# Altium schematic sheet Supply_Source.SchDoc
size A4; SheetNumber: 2; SheetTotal: 15
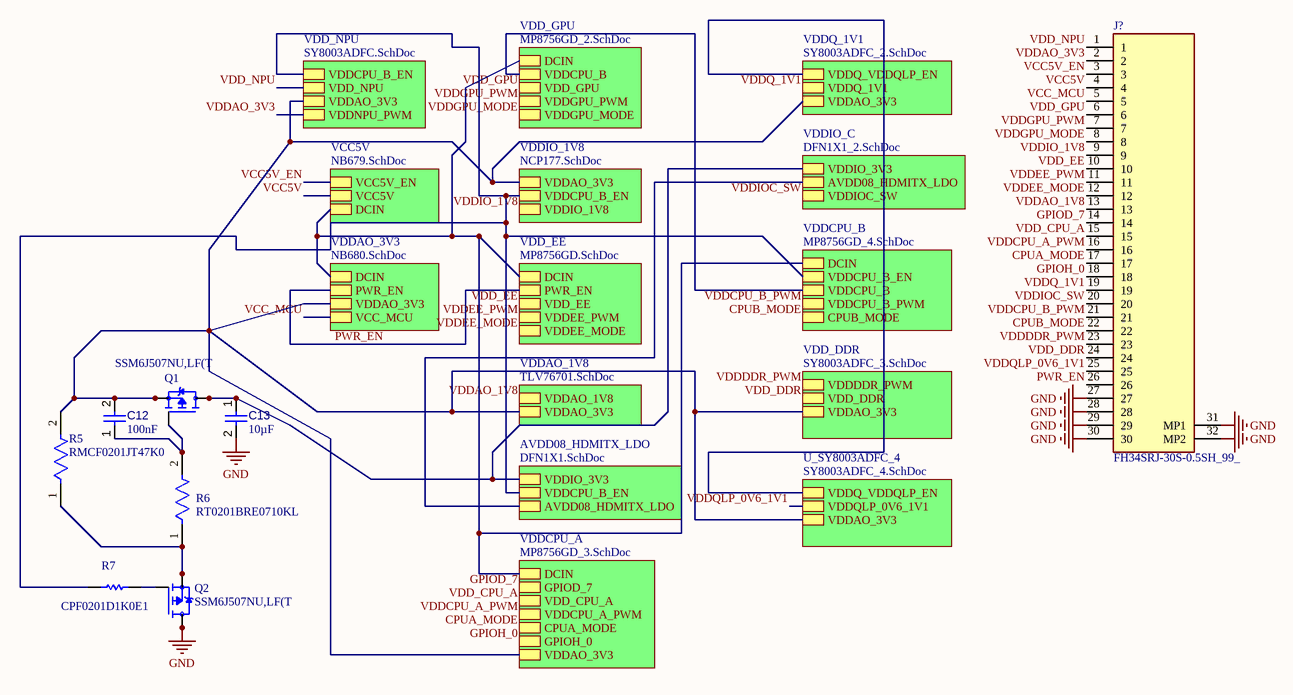
[diagram p0: Supply_Source.SchDoc]

## Parts
C12  value 100nF  [CAPC1005X56X25LL10T15]  (hidden comment: Capacitor 0.1 uF +/- 5% 16 V 0402)
C13  value 10µF  [CAPC0402(1005)60_L]  (hidden comment: Capacitor 10µF +/-40% 6.3V 0402)
J?  FH34SRJ-30S-0.5SH_99_  [FH34SRJ30S05SH99]
Q1  SSM6J507NU,LF(T  [TRANS_SSM6J507NU,LF(T]
Q2  SSM6J507NU,LF(T  [TRANS_SSM6J507NU,LF(T]
R5  RMCF0201JT47K0  [FP-RMCF0201-MFG]
R6  RT0201BRE0710KL  [FP-RT0201-MFG]
R7  CPF0201D1K0E1  [RESC0603X28X15LL05T05]

## Sub-sheets
AVDD08_HDMITX_LDO = DFN1X1.SchDoc: VDDIO_3V3, VDDCPU_B_EN, AVDD08_HDMITX_LDO
U_SY8003ADFC_4 = SY8003ADFC_4.SchDoc: VDDQ_VDDQLP_EN, VDDQLP_0V6_1V1, VDDAO_3V3
VCC5V = NB679.SchDoc: VCC5V_EN, VCC5V, DCIN
VDD_DDR = SY8003ADFC_3.SchDoc: VDDDDR_PWM, VDD_DDR, VDDAO_3V3
VDD_EE = MP8756GD.SchDoc: DCIN, PWR_EN, VDD_EE, VDDEE_PWM, VDDEE_MODE
VDD_GPU = MP8756GD_2.SchDoc: DCIN, VDDCPU_B, VDD_GPU, VDDGPU_PWM, VDDGPU_MODE
VDD_NPU = SY8003ADFC.SchDoc: VDDCPU_B_EN, VDD_NPU, VDDAO_3V3, VDDNPU_PWM
VDDAO_1V8 = TLV76701.SchDoc: VDDAO_1V8, VDDAO_3V3
VDDAO_3V3 = NB680.SchDoc: DCIN, PWR_EN, VDDAO_3V3, VCC_MCU
VDDCPU_A = MP8756GD_3.SchDoc: DCIN, GPIOD_7, VDD_CPU_A, VDDCPU_A_PWM, CPUA_MODE, GPIOH_0, VDDAO_3V3
VDDCPU_B = MP8756GD_4.SchDoc: DCIN, VDDCPU_B_EN, VDDCPU_B, VDDCPU_B_PWM, CPUB_MODE
VDDIO_1V8 = NCP177.SchDoc: VDDAO_3V3, VDDCPU_B_EN, VDDIO_1V8
VDDIO_C = DFN1X1_2.SchDoc: VDDIO_3V3, AVDD08_HDMITX_LDO, VDDIOC_SW
VDDQ_1V1 = SY8003ADFC_2.SchDoc: VDDQ_VDDQLP_EN, VDDQ_1V1, VDDAO_3V3

## Nets
GND: C13.2 J?.27 J?.28 J?.29 J?.30 J?.31(MP1) J?.32(MP2) Q2.1(D) Q2.2(D) Q2.5(D) Q2.6(D) Q2.7(D)
CPUA_MODE: J?.17 ; sheet VDDCPU_A/CPUA_MODE
CPUB_MODE: J?.22 ; sheet VDDCPU_B/CPUB_MODE
GPIOD_7: J?.14 ; sheet VDDCPU_A/GPIOD_7
GPIOH_0: J?.18 ; sheet VDDCPU_A/GPIOH_0
PWR_EN: J?.26 ; sheet VDDAO_3V3/PWR_EN, sheet VDD_EE/PWR_EN
VCC5V: J?.4 ; sheet VCC5V/VCC5V
VCC5V_EN: J?.3 ; sheet VCC5V/VCC5V_EN
VCC_MCU: J?.5 ; sheet VDDAO_3V3/VCC_MCU
VDD_CPU_A: J?.15 ; sheet VDDCPU_A/VDD_CPU_A
VDD_DDR: J?.24 ; sheet VDD_DDR/VDD_DDR
VDD_EE: J?.10 ; sheet VDD_EE/VDD_EE
VDD_GPU: J?.6 ; sheet VDD_GPU/VDD_GPU
VDD_NPU: J?.1 ; sheet VDD_NPU/VDD_NPU
VDDAO_1V8: J?.13 ; sheet VDDAO_1V8/VDDAO_1V8
VDDAO_3V3: J?.2 ; sheet VDD_NPU/VDDNPU_PWM
VDDCPU_A_PWM: J?.16 ; sheet VDDCPU_A/VDDCPU_A_PWM
VDDCPU_B_PWM: J?.21 ; sheet VDDCPU_B/VDDCPU_B_PWM
VDDDDR_PWM: J?.23 ; sheet VDD_DDR/VDDDDR_PWM
VDDEE_MODE: J?.12 ; sheet VDD_EE/VDDEE_MODE
VDDEE_PWM: J?.11 ; sheet VDD_EE/VDDEE_PWM
VDDGPU_MODE: J?.8 ; sheet VDD_GPU/VDDGPU_MODE
VDDGPU_PWM: J?.7 ; sheet VDD_GPU/VDDGPU_PWM
VDDIO_1V8: J?.9 ; sheet VDDIO_1V8/VDDIO_1V8
VDDIOC_SW: J?.20 ; sheet VDDIO_C/VDDIOC_SW
VDDQ_1V1: J?.19 ; sheet VDDQ_1V1/VDDQ_1V1
VDDQLP_0V6_1V1: J?.25 ; sheet U_SY8003ADFC_4/VDDQLP_0V6_1V1
NetC12_1: C12.1 Q1.3(G) R6.2
NetC12_2: C12.2 Q1.4(S) Q1.8(S) R5.2 ; sheet VDDAO_3V3/VDDAO_3V3, sheet VDD_NPU/VDDAO_3V3, sheet VDDIO_1V8/VDDAO_3V3, sheet VDDAO_1V8/VDDAO_3V3, sheet VDDCPU_A/VDDAO_3V3, sheet VDDQ_1V1/VDDAO_3V3, sheet VDD_DDR/VDDAO_3V3, sheet U_SY8003ADFC_4/VDDAO_3V3
NetC13_1: C13.1 Q1.1(D) Q1.2(D) Q1.5(D) Q1.6(D) Q1.7(D) ; sheet AVDD08_HDMITX_LDO/VDDIO_3V3, sheet VDDIO_C/VDDIO_3V3
NetQ2_3: Q2.3(G) R7.2
NetQ2_4: Q2.4(S) Q2.8(S) R5.1 R6.1
NetR7_1: R7.1 ; sheet VDD_NPU/VDDCPU_B_EN, sheet VDDIO_1V8/VDDCPU_B_EN, sheet AVDD08_HDMITX_LDO/VDDCPU_B_EN, sheet VDDCPU_B/VDDCPU_B_EN
(unnamed): sheet VCC5V/DCIN, sheet VDDAO_3V3/DCIN, sheet VDD_GPU/DCIN, sheet VDD_EE/DCIN, sheet VDDCPU_A/DCIN, sheet VDDCPU_B/DCIN
(unnamed): sheet VDD_GPU/VDDCPU_B, sheet VDDCPU_B/VDDCPU_B
(unnamed): sheet AVDD08_HDMITX_LDO/AVDD08_HDMITX_LDO, sheet VDDIO_C/AVDD08_HDMITX_LDO
(unnamed): sheet VDDQ_1V1/VDDQ_VDDQLP_EN, sheet U_SY8003ADFC_4/VDDQ_VDDQLP_EN

## Library data of the parts
C12 = CMP-001-00001-6: Chip Capacitor, 0.1 uF, +/- 5%, 16 V, 0402 (1005 Metric); Capacitor Type: Ceramic; Voltage Rating: 16V; Max Operating Temperature: 125°C; Min Operating Temperature: -55°C; Case/Package: 0402; Mounting Technology: SM; Pins: 2; Tolerance: 5%; RoHS Compliant: True
C13 = CMP-001-00074-3: Chip Capacitor, 10µF +/-40%, 6.3V, 0402, Thickness 0.6 mm; Tolerance: 10%; Case/Package: 0402; Pins: 2; Mounting Technology: SMT; Voltage Rating: 6.3V; Max Operating Temperature: 85°C; Min Operating Temperature: -55°C
J? = CMP-002-00089-2: 30 Position FFC, FPC Connector Contacts, Top and Bottom 0.020" (0.50mm) Surface Mount, Right Angle -55C ~ 105C,50V,0.5A; Manufacturer_Part_Number: FH34SRJ-30S-0.5SH(99); Manufacturer_Name: Hirose; Connector Type: Receptacle; Gender: Female; Geometry.Height: 1.1mm; Mounting Technology: Surface Mount; Mouser Part Number: 798-FH34SRJ30S05SH99; Arrow Price/Stock: *; Mouser Price/Stock: https://www.mouser.co.uk/ProductDetail/Hirose-Connector/FH34SRJ-30S-0.5SH99?qs=%252BAZVS4b%2FkgI%2FlSMlYGcT5g%3D%3D; Source: FH34SRJ-30S-0.5SH_99_.SchLib; Max Operating Temperature: 105°C; Datasheet Link: https://www.hirose.com/product/download/?distributor=digikey&type=2d&lang=en&num=FH34SRJ-30S-0.5SH(99); Pins: 30; Min Operating Temperature: -55°C; Design Item ID: FH34SRJ-30S-0.5SH_99_; Voltage Rating: 50V; Arrow Part Number: *
Q1 Q2 = CMP-029-000000-1: P-Channel 30V 10A (Ta) 1.25W (Ta) Surface Mount 6-UDFNB (2x2); Component Type: Standard; Value: *; Design Item ID: SSM6J507NU,LF(T; Source: SSM6J507NU,LF(T.SchLib; Package: None; Availability: Unavailable; MP: SSM6J507NU,LF(T; Pin Count: 8; Price: None
R5 = CMP-26527-004787-1: 47kΩ ±5% 0.05W 0201 Thick Film Chip Resistor AEC-Q200 compliant; Power Rating: 50mW; Resistance: 47kR; Temperature Coefficient: 200ppm/°C; Length: 0.024inch; RoHS Compliant: Yes; Max Operating Temperature: 125°C; Width: 0.012inch; Case Code (Metric): 0603; Height: 0.009inch; Case Code (Imperial): 0201; Mount: Surface Mount; Tolerance: 5%; Case/Package: 0201; Radiation Hardening: No; Number of Terminations: 2; Min Operating Temperature: -55°C; Series: RMCF; Contact Plating: Tin; Package Quantity: 10000; Packaging: Tape and Reel; Max Power Dissipation: 50mW; Resistor Type: Thick Film
R6 = CMP-03412-006200-1: RT0201 10KΩ 0.05W 50 ppm/°C 0.10%; Manufacturer: Yageo; Voltage Rating: 25V; Tolerance: 0.001; Temperature Range Low: -55°C; Automotive: No; Footprint Url: http://www.yageo.com/exep/pages/download/literatures/PYu-R_Mount_10.pdf; Height: 0.26mm; Device Class L3: Chip SMD Resistors; Lead Free: Yes; Power Rating: 0.05W; Temperature Range High: +125°C; Manufacturer Part Number: RT0201BRE0710KL; Value: 10KΩ; Package: RT0201; ComponentLink2Description: Datasheet; Resistance: 10KΩ; Device Class L2: Resistors; Category: Res; Device Class L1: Passive Components; Composition: Thin Film; Temperature Coefficient: 50 ppm/°C; RoHS: TRUE; ComponentLink2URL: http://www.yageo.com/documents/recent/PYu-RT_1-to-0.01_RoHS_L_9.pdf; Ipc Land Pattern Name: RESC6030X23; Series: RT; Octopart: https://octopart.com/rt0201bre0710kl-yageo-87214258; Temperature: -55°C to +125°C
R7 = CMP-2004-03891-1: Manufacturer: TE Connectivity / AMP; Part Number: CPF0201D1K0E1